# Altium schematic sheet 10X SD CARD READER SCH SHEET 1.SchDoc
size A3
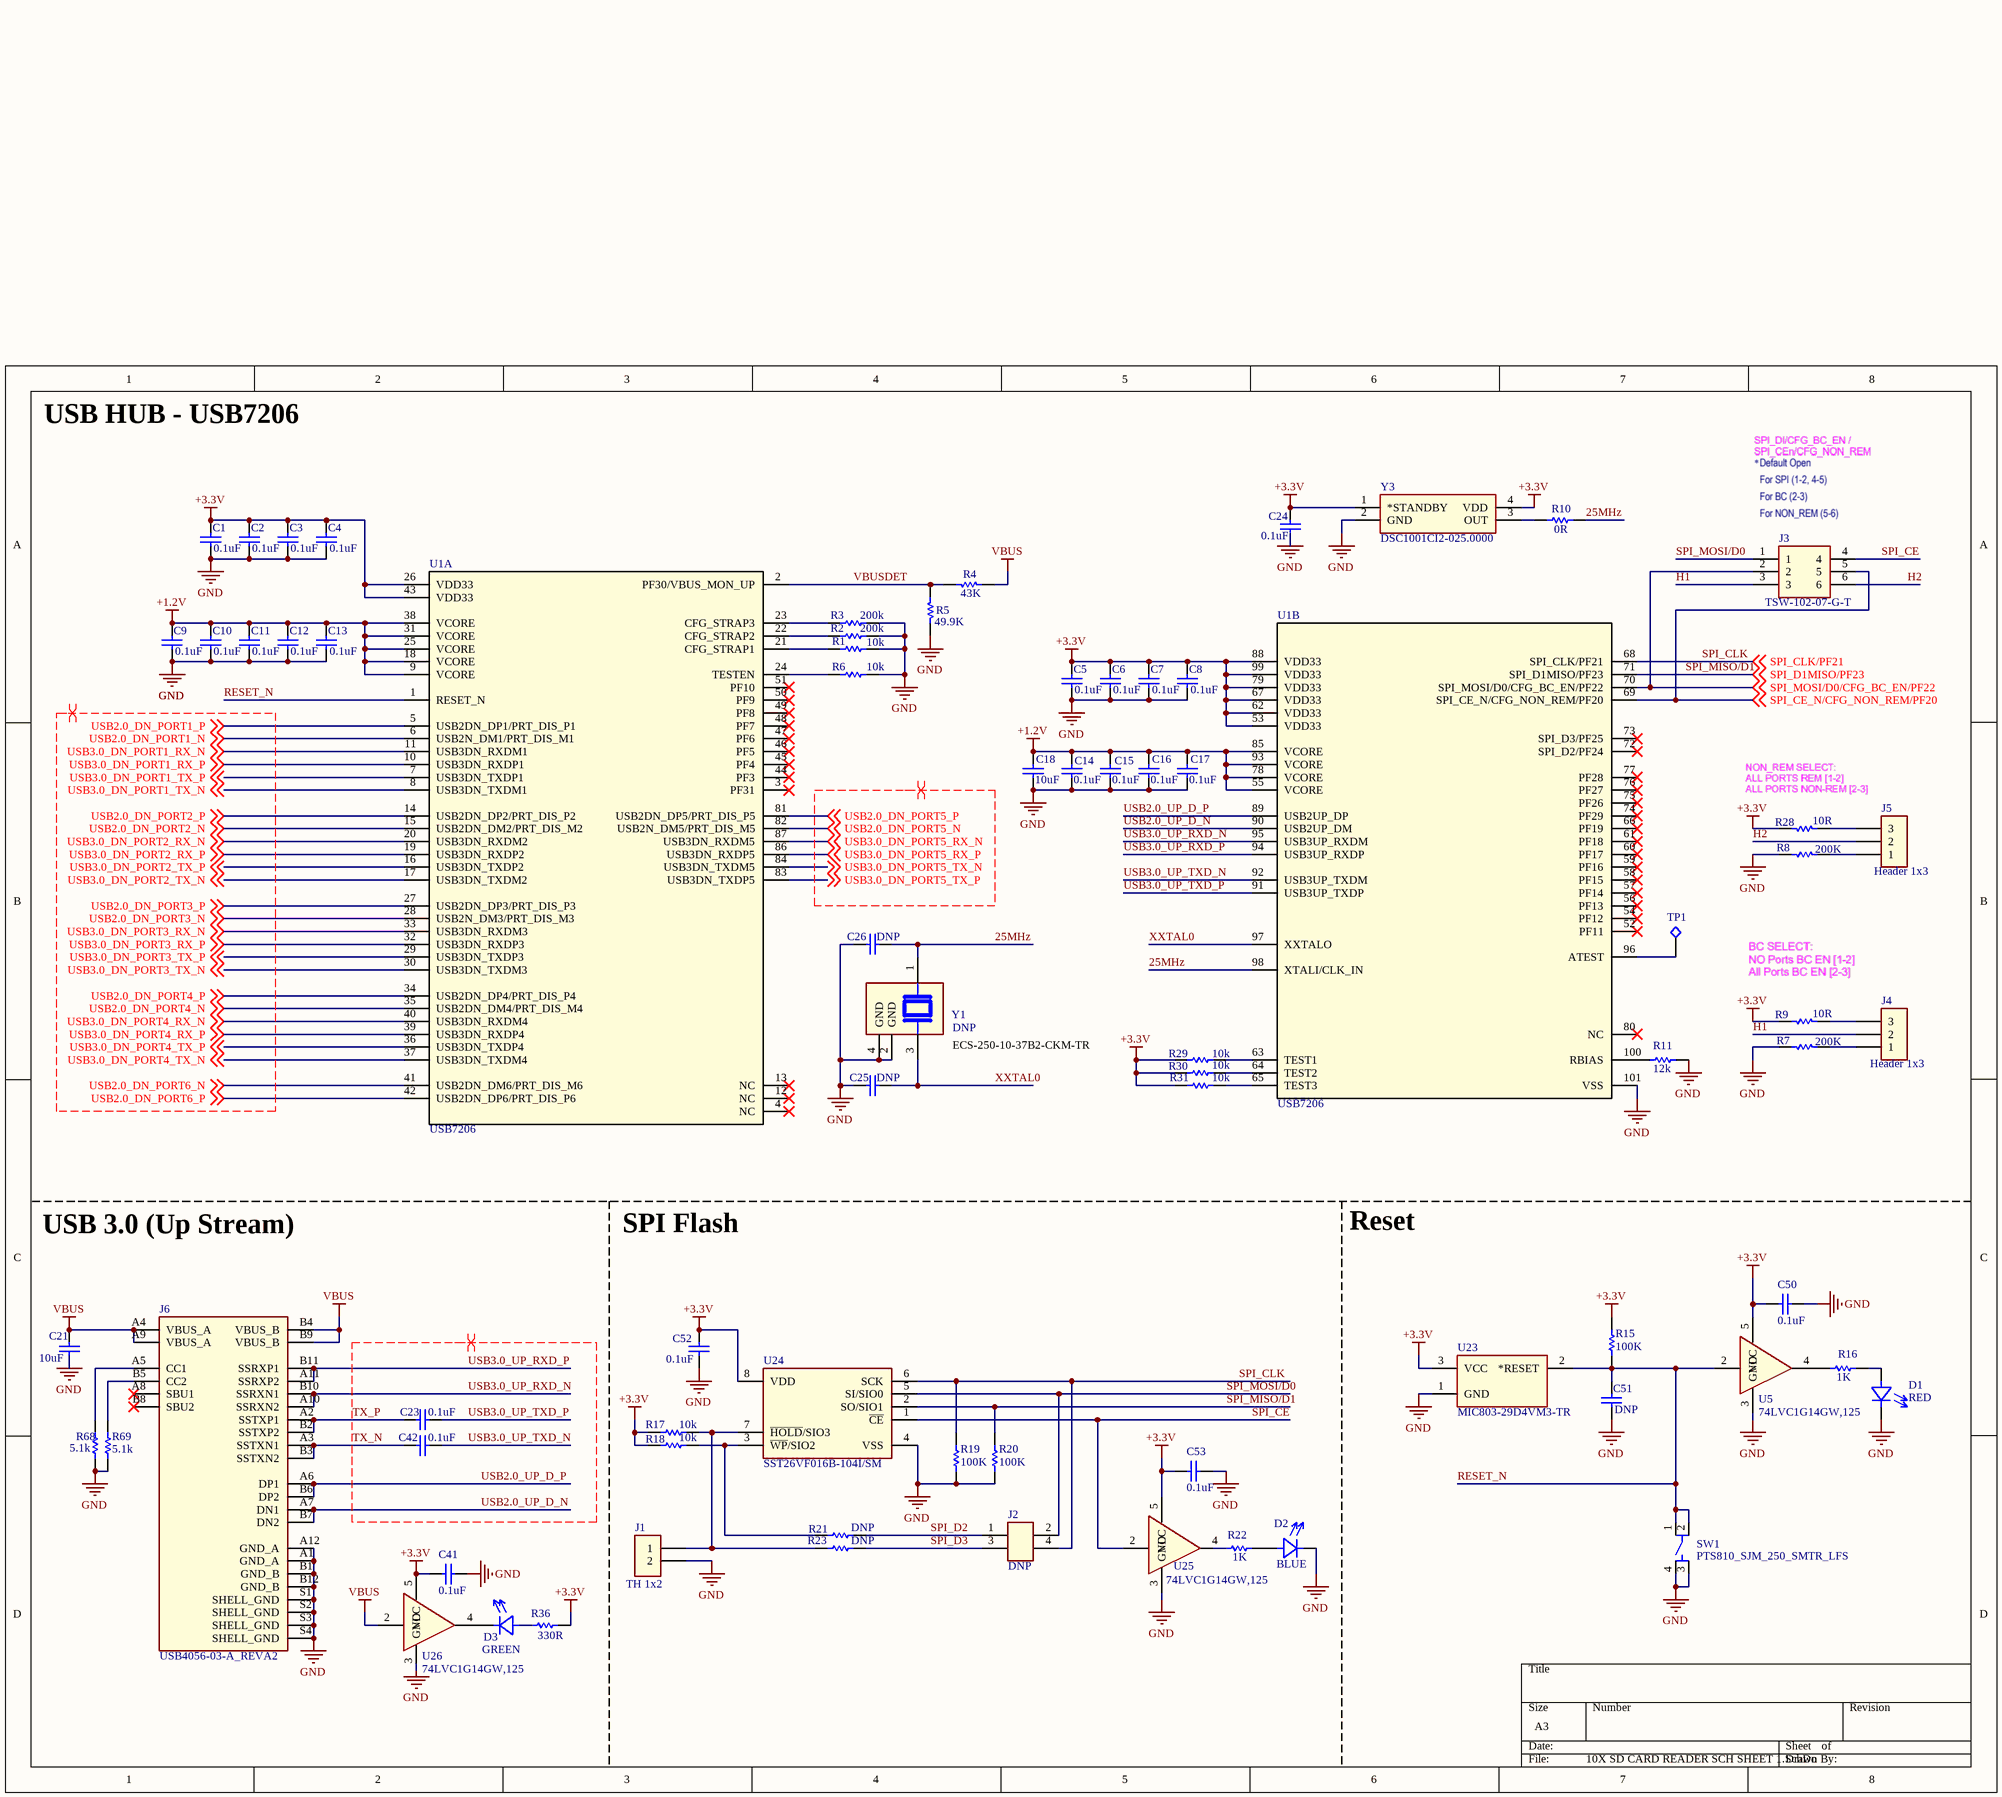
[diagram p0: 10X SD CARD READER SCH SHEET 1.SchDoc]

## Parts
C1  0.1uF  [C-0402/1005]
C2  0.1uF  [C-0402/1005]
C3  0.1uF  [C-0402/1005]
C4  0.1uF  [C-0402/1005]
C5  0.1uF  [C-0402/1005]
C6  0.1uF  [C-0402/1005]
C7  0.1uF  [C-0402/1005]
C8  0.1uF  [C-0402/1005]
C9  0.1uF  [C-0402/1005]
C10  0.1uF  [C-0402/1005]
C11  0.1uF  [C-0402/1005]
C12  0.1uF  [C-0402/1005]
C13  0.1uF  [C-0402/1005]
C14  0.1uF  [C-0402/1005]
C15  0.1uF  [C-0402/1005]
C16  0.1uF  [C-0402/1005]
C17  0.1uF  [C-0402/1005]
C18  10uF  [C-0805/2012]
C21  10uF  [C-0805/2012]
C23  0.1uF  [C-0402/1005]
C24  0.1uF  [C-0402/1005]
C25  DNP  [R-0402/1005]
C26  DNP  [R-0402/1005]
C41  0.1uF  [C-0402/1005]
C42  0.1uF  [C-0402/1005]
C50  0.1uF  [C-0402/1005]
C51  value DNP  [C-0402/1005]  (hidden comment: 0.1uF)
C52  0.1uF  [C-0402/1005]
C53  0.1uF  [C-0402/1005]
D1  RED  [LEDC1608X65N]
D2  BLUE  [LEDC1608X65N]
D3  GREEN  [LEDC1608X65N]
J1  TH 1x2  [PIN HEADER 1x2 2.54mm]
J2  DNP  [PIN HEADER 2x2 2.54mm]
J3  TSW-102-07-G-T  [CON6_3X2_TU_TSW_SAI]
J4  Header 1x3  [PIN HEADER 1x3 2.54mm]
J5  Header 1x3  [PIN HEADER 1x3 2.54mm]
J6  USB4056-03-A_REVA2  [GCT_USB4056-03-A_REVA2]
R1  10k  [R-0402/1005]
R2  200k  [R-0402/1005]
R3  200k  [R-0402/1005]
R4  43K  [R-0402/1005]
R5  49.9K  [R-0402/1005]
R6  10k  [R-0402/1005]
R7  200K  [R-0402/1005]
R8  200K  [R-0402/1005]
R9  10R  [R-0402/1005]
R10  0R  [R-0402/1005]
R11  12k  [R-0402/1005]
R15  100K  [R-0402/1005]
R16  1K  [R-0402/1005]
R17  10k  [R-0402/1005]
R18  10k  [R-0402/1005]
R19  100K  [R-0402/1005]
R20  100K  [R-0402/1005]
R21  DNP  [R-0402/1005]
R22  1K  [R-0402/1005]
R23  DNP  [R-0402/1005]
R28  10R  [R-0402/1005]
R29  10k  [R-0402/1005]
R30  10k  [R-0402/1005]
R31  10k  [R-0402/1005]
R36  330R  [R-0402/1005]
R68  5.1k  [R-0402/1005]
R69  5.1k  [R-0402/1005]
SW1  PTS810_SJM_250_SMTR_LFS  [SW_PTS810_SJM_250_SMTR_LFS]
TP1  Test Points  [Test Point TH Round H0.9,D1.6]  (value not drawn)
U1  USB7206  [USB7206]  (parts A,B of 2)
U5  74LVC1G14GW,125  [SOT65P212X110-5N]
U23  MIC803-29D4VM3-TR  [SOT-23_M3_MCH]
U24  SST26VF016B-104I/SM  [SOIC127P794X203-8N]
U25  74LVC1G14GW,125  [SOT65P212X110-5N]
U26  74LVC1G14GW,125  [SOT65P212X110-5N]
Y1  DNP  [ECS-250-10-37B2]
Y3  DSC1001CI2-025.0000  [CDFN4_3P2X2P5_MCH]

## Nets
+1.2V: C9.2 C10.2 C11.2 C12.2 C13.2 C14.1 C15.1 C16.2 C17.2 C18.2 U1.9(VCORE) U1.18(VCORE) U1.25(VCORE) U1.31(VCORE) U1.38(VCORE) U1.55(VCORE) U1.78(VCORE) U1.85(VCORE) U1.93(VCORE)
+3.3V: C1.2 C2.2 C3.2 C4.2 C5.2 C6.2 C7.2 C8.2 C24.2 C41.2 C50.2 C52.2 C53.2 R9.2 R15.1 R17.2 R18.2 R28.2 R29.2 R30.2 R31.2 R36.2 U1.26(VDD33) U1.43(VDD33) U1.53(VDD33) U1.62(VDD33) U1.67(VDD33) U1.79(VDD33) U1.88(VDD33) U1.99(VDD33) U5.5(VCC) U23.3(VCC) U24.8(VDD) U25.5(VCC) U26.5(VCC) Y3.1(*STANDBY) Y3.4(VDD)
GND: C1.1 C2.1 C3.1 C4.1 C5.1 C6.1 C7.1 C8.1 C9.1 C10.1 C11.1 C12.1 C13.1 C14.2 C15.2 C16.1 C17.1 C18.1 C21.1 C24.1 C25.2 C26.2 C41.1 C50.1 C51.1 C52.1 C53.1 D1.C D2.C J1.2 J6.A1(GND_A) J6.A12(GND_A) J6.B1(GND_B) J6.B12(GND_B) J6.S1(SHELL_GND) J6.S2(SHELL_GND) J6.S3(SHELL_GND) J6.S4(SHELL_GND) R1.2 R2.2 R3.2 R5.2 R6.1 R7.1 R8.1 R11.1 R19.2 R20.2 R68.1 R69.1 SW1.3 SW1.4 U1.101(VSS) U5.3(GND) U23.1(GND) U24.4(VSS) U25.3(GND) U26.3(GND) Y1.2(GND) Y1.4(GND) Y3.2(GND)
VBUS: C21.2 J6.A4(VBUS_A) J6.A9(VBUS_A) J6.B4(VBUS_B) J6.B9(VBUS_B) R4.2 U26.2(A)
25MHz: C26.1 R10.2 U1.98(XTALI/CLK_IN) Y1.1
H1: J3.3 J4.2
H2: J3.6 J5.2
RESET_N: C51.2 R15.2 SW1.1 SW1.2 U1.1(RESET_N) U5.2(A) U23.2(*RESET)
SPI_CE: J3.4 U24.1(~{CE}) U25.2(A)
SPI_CE_N/CFG_NON_REM/PF20: J3.5 U1.69(SPI_CE_N/CFG_NON_REM/PF20) ; off-sheet SPI_CE_N/CFG_NON_REM/PF20
SPI_CLK: J2.4 R19.1 U1.68(SPI_CLK/PF21) U24.6(SCK) ; off-sheet SPI_CLK/PF21  [also labelled SPI_CLK/PF21]
SPI_D2: J2.1 R21.2
SPI_D3: J2.3 R23.2
SPI_MISO/D1: R20.1 U1.71(SPI_D1MISO/PF23) U24.2(SO/SIO1) ; off-sheet SPI_D1MISO/PF23  [also labelled SPI_D1MISO/PF23]
SPI_MOSI/D0: J2.2 J3.1 U24.5(SI/SIO0)
SPI_MOSI/D0/CFG_BC_EN/PF22: J3.2 U1.70(SPI_MOSI/D0/CFG_BC_EN/PF22) ; off-sheet SPI_MOSI/D0/CFG_BC_EN/PF22
TX_N: C42.2 J6.A3(SSTXN1) J6.B3(SSTXN2)
TX_P: C23.2 J6.A2(SSTXP1) J6.B2(SSTXP2)
USB2.0_DN_PORT1_N: U1.6(USB2N_DM1/PRT_DIS_M1) ; off-sheet USB2.0_DN_PORT1_N
USB2.0_DN_PORT1_P: U1.5(USB2DN_DP1/PRT_DIS_P1) ; off-sheet USB2.0_DN_PORT1_P
USB2.0_DN_PORT2_N: U1.15(USB2DN_DM2/PRT_DIS_M2) ; off-sheet USB2.0_DN_PORT2_N
USB2.0_DN_PORT2_P: U1.14(USB2DN_DP2/PRT_DIS_P2) ; off-sheet USB2.0_DN_PORT2_P
USB2.0_DN_PORT3_N: U1.28(USB2N_DM3/PRT_DIS_M3) ; off-sheet USB2.0_DN_PORT3_N
USB2.0_DN_PORT3_P: U1.27(USB2DN_DP3/PRT_DIS_P3) ; off-sheet USB2.0_DN_PORT3_P
USB2.0_DN_PORT4_N: U1.35(USB2DN_DM4/PRT_DIS_M4) ; off-sheet USB2.0_DN_PORT4_N
USB2.0_DN_PORT4_P: U1.34(USB2DN_DP4/PRT_DIS_P4) ; off-sheet USB2.0_DN_PORT4_P
USB2.0_DN_PORT5_N: U1.82(USB2N_DM5/PRT_DIS_M5) ; off-sheet USB2.0_DN_PORT5_N
USB2.0_DN_PORT5_P: U1.81(USB2DN_DP5/PRT_DIS_P5) ; off-sheet USB2.0_DN_PORT5_P
USB2.0_DN_PORT6_N: U1.41(USB2DN_DM6/PRT_DIS_M6) ; off-sheet USB2.0_DN_PORT6_N
USB2.0_DN_PORT6_P: U1.42(USB2DN_DP6/PRT_DIS_P6) ; off-sheet USB2.0_DN_PORT6_P
USB2.0_UP_D_N: J6.A7(DN1) J6.B7(DN2) U1.90(USB2UP_DM)
USB2.0_UP_D_P: J6.A6(DP1) J6.B6(DP2) U1.89(USB2UP_DP)
USB3.0_DN_PORT1_RX_N: U1.11(USB3DN_RXDM1) ; off-sheet USB3.0_DN_PORT1_RX_N
USB3.0_DN_PORT1_RX_P: U1.10(USB3DN_RXDP1) ; off-sheet USB3.0_DN_PORT1_RX_P
USB3.0_DN_PORT1_TX_N: U1.8(USB3DN_TXDM1) ; off-sheet USB3.0_DN_PORT1_TX_N
USB3.0_DN_PORT1_TX_P: U1.7(USB3DN_TXDP1) ; off-sheet USB3.0_DN_PORT1_TX_P
USB3.0_DN_PORT2_RX_N: U1.20(USB3DN_RXDM2) ; off-sheet USB3.0_DN_PORT2_RX_N
USB3.0_DN_PORT2_RX_P: U1.19(USB3DN_RXDP2) ; off-sheet USB3.0_DN_PORT2_RX_P
USB3.0_DN_PORT2_TX_N: U1.17(USB3DN_TXDM2) ; off-sheet USB3.0_DN_PORT2_TX_N
USB3.0_DN_PORT2_TX_P: U1.16(USB3DN_TXDP2) ; off-sheet USB3.0_DN_PORT2_TX_P
USB3.0_DN_PORT3_RX_N: U1.33(USB3DN_RXDM3) ; off-sheet USB3.0_DN_PORT3_RX_N
USB3.0_DN_PORT3_RX_P: U1.32(USB3DN_RXDP3) ; off-sheet USB3.0_DN_PORT3_RX_P
USB3.0_DN_PORT3_TX_N: U1.30(USB3DN_TXDM3) ; off-sheet USB3.0_DN_PORT3_TX_N
USB3.0_DN_PORT3_TX_P: U1.29(USB3DN_TXDP3) ; off-sheet USB3.0_DN_PORT3_TX_P
USB3.0_DN_PORT4_RX_N: U1.40(USB3DN_RXDM4) ; off-sheet USB3.0_DN_PORT4_RX_N
USB3.0_DN_PORT4_RX_P: U1.39(USB3DN_RXDP4) ; off-sheet USB3.0_DN_PORT4_RX_P
USB3.0_DN_PORT4_TX_N: U1.37(USB3DN_TXDM4) ; off-sheet USB3.0_DN_PORT4_TX_N
USB3.0_DN_PORT4_TX_P: U1.36(USB3DN_TXDP4) ; off-sheet USB3.0_DN_PORT4_TX_P
USB3.0_DN_PORT5_RX_N: U1.87(USB3DN_RXDM5) ; off-sheet USB3.0_DN_PORT5_RX_N
USB3.0_DN_PORT5_RX_P: U1.86(USB3DN_RXDP5) ; off-sheet USB3.0_DN_PORT5_RX_P
USB3.0_DN_PORT5_TX_N: U1.84(USB3DN_TXDM5) ; off-sheet USB3.0_DN_PORT5_TX_N
USB3.0_DN_PORT5_TX_P: U1.83(USB3DN_TXDP5) ; off-sheet USB3.0_DN_PORT5_TX_P
USB3.0_UP_RXD_N: J6.A10(SSRXN2) J6.B10(SSRXN1) U1.95(USB3UP_RXDM)
USB3.0_UP_RXD_P: J6.A11(SSRXP2) J6.B11(SSRXP1) U1.94(USB3UP_RXDP)
USB3.0_UP_TXD_N: C42.1 U1.92(USB3UP_TXDM)
USB3.0_UP_TXD_P: C23.1 U1.91(USB3UP_TXDP)
VBUSDET: R4.1 R5.1 U1.2(PF30/VBUS_MON_UP)
XXTAL0: C25.1 U1.97(XXTALO) Y1.3
NetD1_A: D1.A R16.1
NetD2_A: D2.A R22.1
NetD3_A: D3.A R36.1
NetD3_C: D3.C U26.4(~{Y})
NetJ1_1: J1.1 R17.1 R23.1 U24.7(~{HOLD}/SIO3)
NetJ4_1: J4.1 R7.2
NetJ4_3: J4.3 R9.1
NetJ5_1: J5.1 R8.2
NetJ5_3: J5.3 R28.1
NetJ6_A5: J6.A5(CC1) R68.2
NetJ6_B5: J6.B5(CC2) R69.2
NetR1_1: R1.1 U1.21(CFG_STRAP1)
NetR2_1: R2.1 U1.22(CFG_STRAP2)
NetR3_1: R3.1 U1.23(CFG_STRAP3)
NetR6_2: R6.2 U1.24(TESTEN)
NetR10_1: R10.1 Y3.3(OUT)
NetR11_2: R11.2 U1.100(RBIAS)
NetR16_2: R16.2 U5.4(~{Y})
NetR18_1: R18.1 R21.1 U24.3(~{WP}/SIO2)
NetR22_2: R22.2 U25.4(~{Y})
NetR29_1: R29.1 U1.63(TEST1)
NetR30_1: R30.1 U1.64(TEST2)
NetR31_1: R31.1 U1.65(TEST3)
NetTP1_1: TP1.1 U1.96(ATEST)

Not connected (* = marked no-connect by the designer): J6 A8(SBU1)* B8(SBU2)*; U1 3(PF31)* 4(NC)* 12(NC)* 13(NC)* 44(PF3)* 45(PF4)* 46(PF5)* 47(PF6)* 48(PF7)* 49(PF8)* 50(PF9)* 51(PF10)* 52(PF11)* 54(PF12)* 56(PF13)* 57(PF14)* 58(PF15)* 59(PF16)* 60(PF17)* 61(PF18)* 66(PF19)* 72(SPI_D2/PF24)* 73(SPI_D3/PF25)* 74(PF29)* 75(PF26)* 76(PF27)* 77(PF28)* 80(NC)*

## Layout directives
differential pair; differential pair class Diff_90R: TX_N, TX_P, USB2.0_DN_PORT1_N, USB2.0_DN_PORT1_P, USB2.0_DN_PORT2_N, USB2.0_DN_PORT2_P, USB2.0_DN_PORT3_N, USB2.0_DN_PORT3_P, USB2.0_DN_PORT4_N, USB2.0_DN_PORT4_P, USB2.0_DN_PORT5_N, USB2.0_DN_PORT5_P, USB2.0_DN_PORT6_N, USB2.0_DN_PORT6_P, USB2.0_UP_D_N, USB2.0_UP_D_P, USB3.0_DN_PORT1_RX_N, USB3.0_DN_PORT1_RX_P, USB3.0_DN_PORT1_TX_N, USB3.0_DN_PORT1_TX_P, USB3.0_DN_PORT2_RX_N, USB3.0_DN_PORT2_RX_P, USB3.0_DN_PORT2_TX_N, USB3.0_DN_PORT2_TX_P, USB3.0_DN_PORT3_RX_N, USB3.0_DN_PORT3_RX_P, USB3.0_DN_PORT3_TX_N, USB3.0_DN_PORT3_TX_P, USB3.0_DN_PORT4_RX_N, USB3.0_DN_PORT4_RX_P, USB3.0_DN_PORT4_TX_N, USB3.0_DN_PORT4_TX_P, USB3.0_DN_PORT5_RX_N, USB3.0_DN_PORT5_RX_P, USB3.0_DN_PORT5_TX_N, USB3.0_DN_PORT5_TX_P, USB3.0_UP_RXD_N, USB3.0_UP_RXD_P, USB3.0_UP_TXD_N, USB3.0_UP_TXD_P

## Notes on the sheet
- USB HUB - USB7206
- (near Y1) ECS-250-10-37B2-CKM-TR
- USB 3.0 (Up Stream)
- SPI Flash
- Reset

## Library data of the parts
C1-C18 C23 C24 C41 C42 C50-C53 = Cap: Capacitor; Published: 8-Jun-2000; LatestRevisionDate: 17-Jul-2002; LatestRevisionNote: Re-released for DXP Platform.; PackageReference: RAD-0.3; Publisher: Altium Limited; PackageDescription: Radial Cap, Thru-Hole; 2 Leads; 0.3 in Pin Spacing
  C1-C17 C23 C24 C41 C42 C50 C52 C53: Value: 0.1uF
  C18: Value: 10uF
C21 C25 C26 = Cap: Capacitor; Value: 0.1uF; Published: 8-Jun-2000; LatestRevisionDate: 17-Jul-2002; LatestRevisionNote: Re-released for DXP Platform.; PackageReference: RAD-0.3; Publisher: Altium Limited; PackageDescription: Radial Cap, Thru-Hole; 2 Leads; 0.3 in Pin Spacing
D1-D3 = Diode-LED: Supplier: Digikey Electronics
J1 = Header 1x2: CONN HEADER VERT 3POS 2.54MM; Mfr. Part No.: 75160-156-03LF; Value: 51R; Unit Price (USD): 0.74; Supplier Part No.: 609-75160-156-03LF-ND; Supplier: Digikey Electronics
J2 = Header 2x2: FIXED IND 22UH 620MA 350 MOHM; Mfr. Part No.: PH2-04-UA; Unit Price (USD): 0.1; Supplier Part No.: 2057-PH2-04-UA-ND; Supplier: Digikey Electronics
J3 = TSW-102-07-G-T: No Description Available; Mfr_Name: Samtec Inc; Copyright: Copyright (C) 2023 Ultra Librarian. All rights reserved.; Manufacturer_Part_Number: TSW-102-07-G-T; Digi-Key_Part_Number_1: TSW-102-07-G-T-ND; RefDes: RefDes; Type: DEV
J4 J5 = Header 1x3: CONN HEADER VERT 3POS 2.54MM; Mfr. Part No.: 75160-156-03LF; Value: 51R; Unit Price (USD): 0.74; Supplier Part No.: 609-75160-156-03LF-ND; Supplier: Digikey Electronics
J6 = USB4056-03-A_REVA2: USB-C (USB TYPE-C) USB 3.2 Gen 2 (USB 3.1 Gen 2, Superspeed + (USB 3.1)) Receptacle Connector 24 Position Surface Mount, Right Angle; Through Hole; MF: Global Connector Technology; Package: None; Check_prices: https://www.snapeda.com/parts/USB4056-03-A/Global+Connector+Technology/view-part/?ref=eda; Value: *; Availability: In Stock; SnapEDA_Link: https://www.snapeda.com/parts/USB4056-03-A/Global+Connector+Technology/view-part/?ref=snap; MP: USB4056-03-A; Price: None
R1-R3 R6 R17 R18 R29-R31 = Res1: Resistor; Published: 8-Jun-2000; LatestRevisionDate: 17-Jul-2002; LatestRevisionNote: Re-released for DXP Platform.; PackageReference: AXIAL-0.3; Publisher: Altium Limited; PackageDescription: Axial Device, Thru-Hole; 2 Leads; 0.3 in Pin Spacing
  R1 R6 R17 R18 R29-R31: Value: 10K
  R2 R3: Value: 200K
R4 R5 R7-R9 R11 R15 R16 R19 R20 R22 R28 R36 = Res1: Resistor; Value: 10K; Published: 8-Jun-2000; LatestRevisionDate: 17-Jul-2002; LatestRevisionNote: Re-released for DXP Platform.; PackageReference: AXIAL-0.3; Publisher: Altium Limited; PackageDescription: Axial Device, Thru-Hole; 2 Leads; 0.3 in Pin Spacing
R10 R21 R23 R68 R69 = Res1: Resistor; Value: 200K; Published: 8-Jun-2000; LatestRevisionDate: 17-Jul-2002; LatestRevisionNote: Re-released for DXP Platform.; PackageReference: AXIAL-0.3; Publisher: Altium Limited; PackageDescription: Axial Device, Thru-Hole; 2 Leads; 0.3 in Pin Spacing
SW1 = PTS810_SJM_250_SMTR_LFS: Tactile Switch SPST-NO Top Actuated Surface Mount; MF: C&K; MP: PTS810 SJM 250 SMTR LFS; Price: None; Package: None; Availability: Unavailable; Value: *; SnapEDA_Link: https://www.snapeda.com/parts/PTS810%20SJM%20250%20SMTR%20LFS/C%26K/view-part/522770/?ref=snap
U1 = USB7206: IC USB3.1 GEN2 HUB TYPE C; Manufacturer: Microchip Technology; Manufacturer Product Number: USB7206CT-I/KDX; Digi-Key Part Number: 150-USB7206CT-I/KDXTR-ND; Unit Price: $12.9; Stock: 4935
U5 U25 U26 = 74LVC1G14GW,125: Inverter Schmitt Trigger 1-Element CMOS 5-Pin TSSOP T/R; Price: None; Availability: Unavailable; MP: 74LVC1G14GW,125; Value: *; Package: None
U23 = MIC803-29D4VM3-TR: No Description Available; Mfr_Name: Microchip; Copyright: Copyright (C) 2023 Ultra Librarian. All rights reserved.; Manufacturer_Part_Number: MIC803-29D4VM3-TR; Digi-Key_Part_Number_1: 576-3806-1-ND; Digi-Key_Part_Number_2: 576-3806-2-ND; Digi-Key_Part_Number_3: 576-3806-6-ND; RefDes: RefDes; Type: DEV
Y1 = ECS-250-10-37B2-CKM-TR
Y3 = DSC1001CI2-025.0000: No Description Available; Mfr_Name: Microchip; Copyright: Copyright (C) 2023 Ultra Librarian. All rights reserved.; Manufacturer_Part_Number: DSC1001CI2-025.0000; Digi-Key_Part_Number_1: 576-4957-5-ND; RefDes: RefDes; Type: DEV